# EAGLE board reg-board (EAGLE 8.7.0)
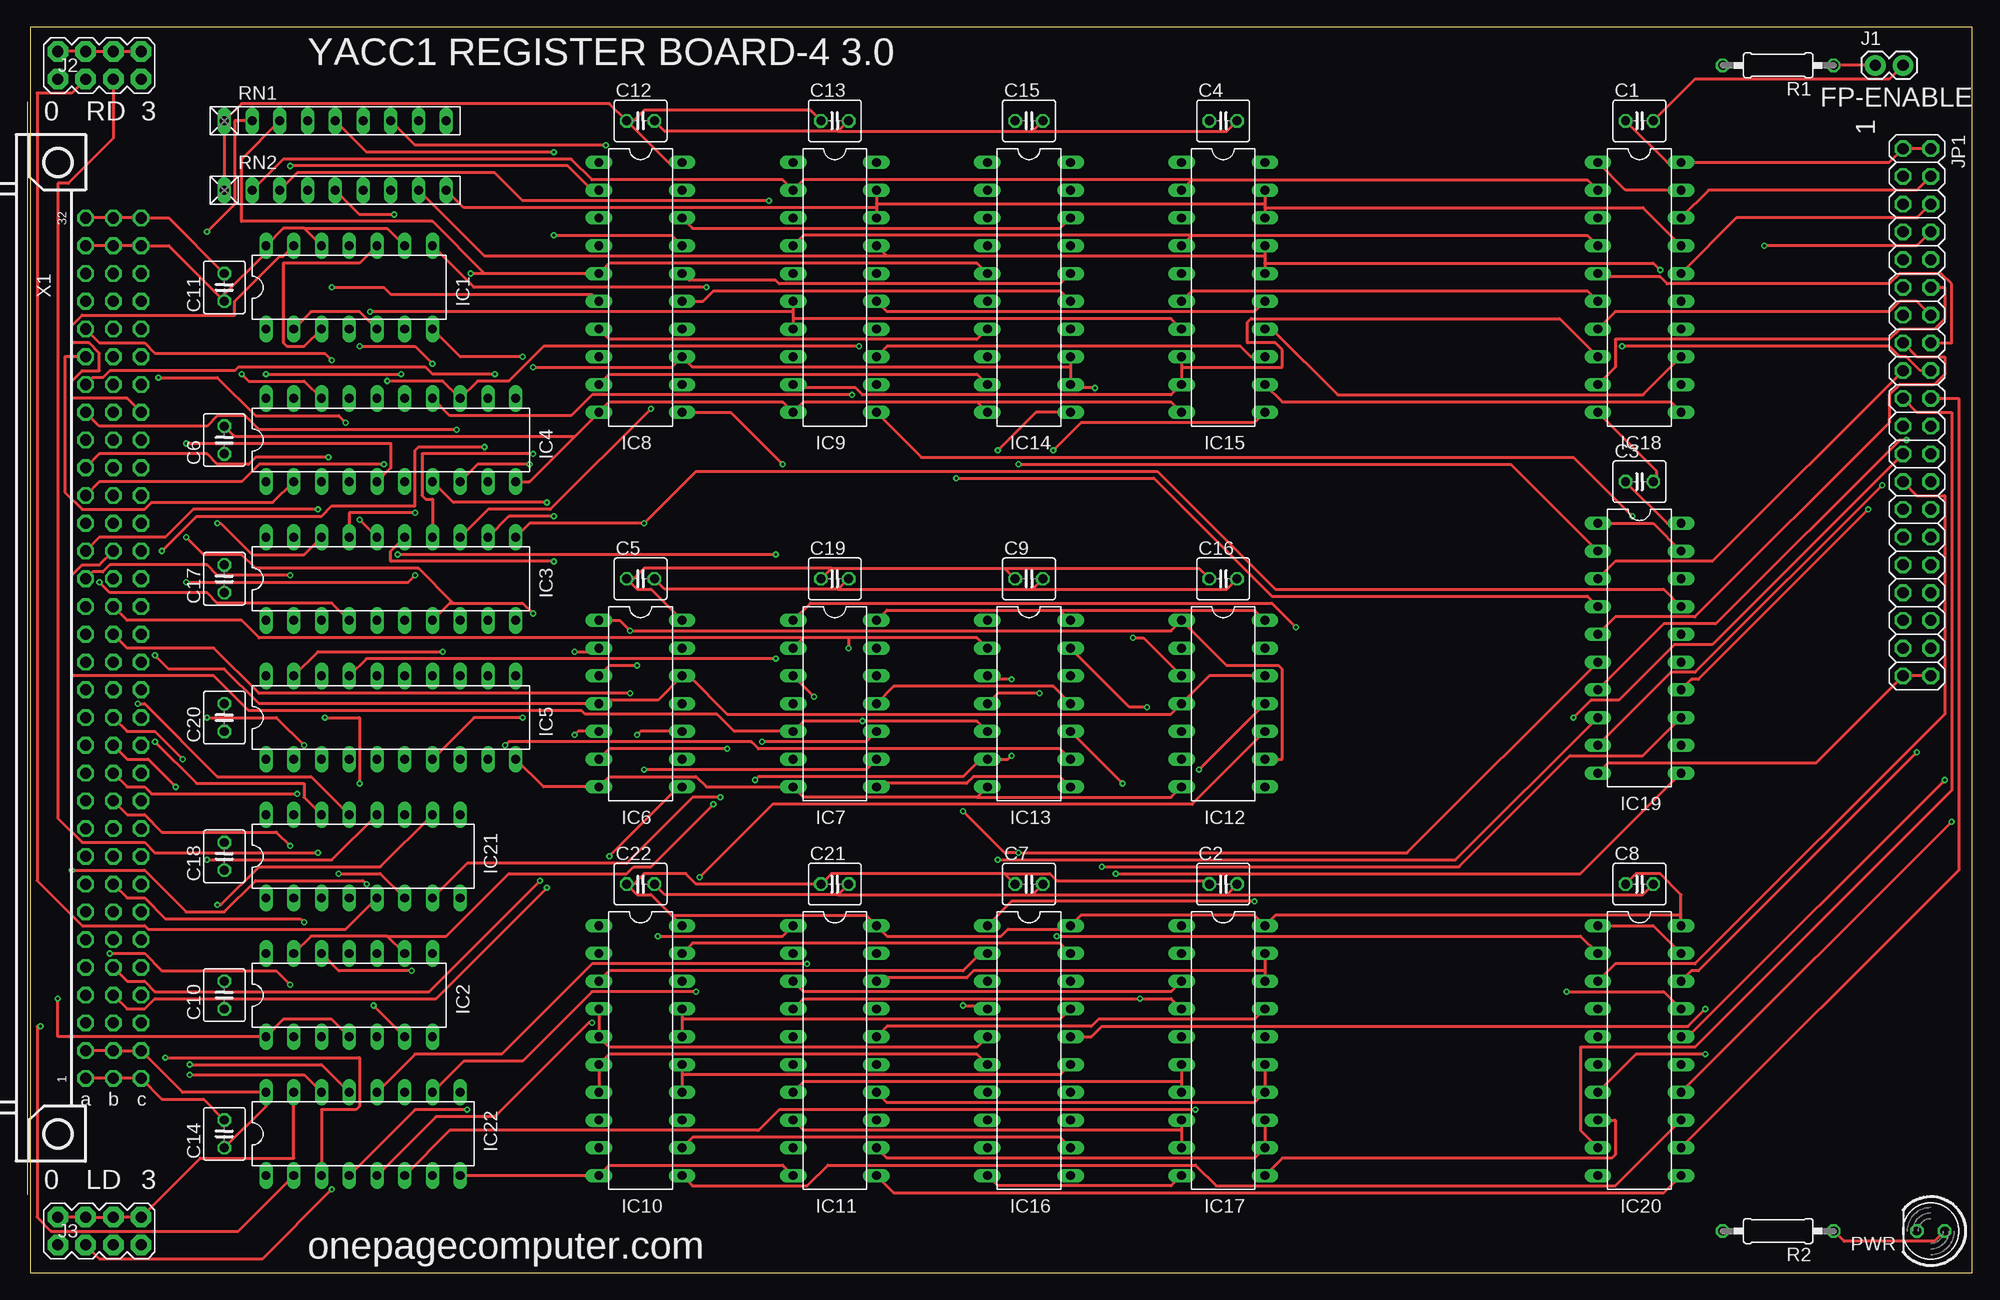
[diagram p5: board, top side]
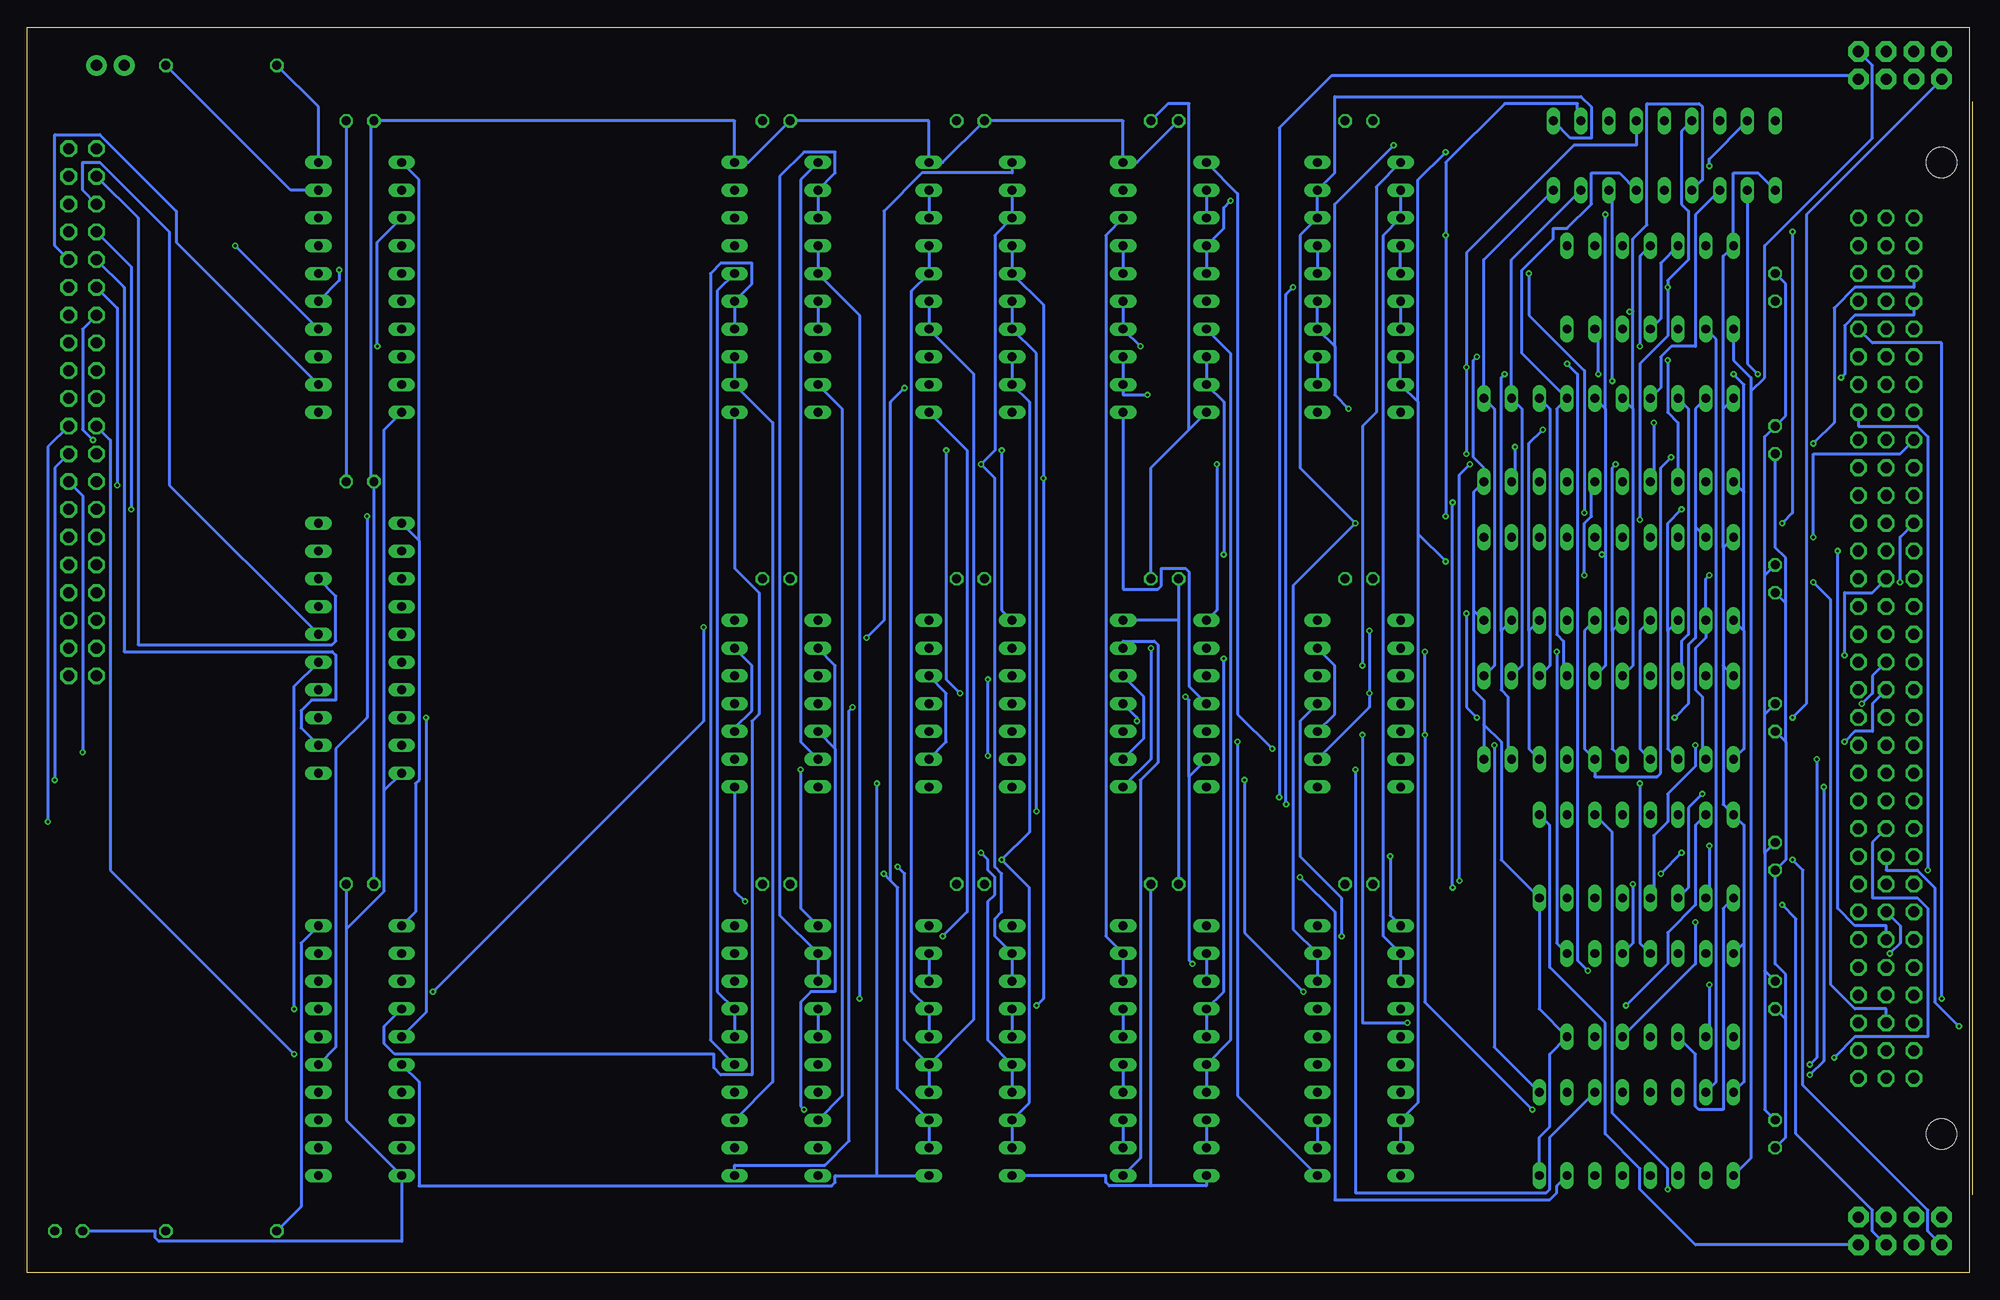
[diagram p6: board, bottom side, seen from below]

Size 177.78 x 113.97 mm. Coordinates in mm from the lower left corner, seen from the top.
Outline: 0,0 177.78,0 177.78,113.97 0,113.97 0,0
Copper layers (1*16): Top 0.035559375mm / dielectric 1.6mm / Bottom 0.035559375mm
Design rules "oshpark-2layer-auto-routing": minimum track width 10mil, minimum drill 10mil, track to track 10mil, track to pad 8mil, pad to pad 8mil, via to via 8mil, smd to smd 6mil, copper to edge 15mil, drill to drill 6mil, minimum pad ring 6mil, minimum via ring 6mil, stop-mask expansion 2.5mil, vias tented up to drill 0mil, thermal gap 10mil
Net classes: 1 GND: width 1 mm; 2 5V: width 1 mm

## Footprints (pad centres in the part's own frame; a part is rotated, then mirrored left to right if it is on the bottom)
C025-040X050 = drill 0.813 octagon: 1 -1.27,0; 2 1.27,0
DIL14 = drill 0.813 long: 1 -7.62,-3.81; 2 -5.08,-3.81; 3 -2.54,-3.81; 4 0,-3.81; 5 2.54,-3.81; 6 5.08,-3.81; 7 7.62,-3.81; 8 7.62,3.81; 9 5.08,3.81; 10 2.54,3.81; 11 0,3.81; 12 -2.54,3.81; 13 -5.08,3.81; 14 -7.62,3.81
DIL20 = drill 0.813 long: 1 -11.43,-3.81; 2 -8.89,-3.81; 3 -6.35,-3.81; 4 -3.81,-3.81; 5 -1.27,-3.81; 6 1.27,-3.81; 7 3.81,-3.81; 8 6.35,-3.81; 9 8.89,-3.81; 10 11.43,-3.81; 11 11.43,3.81; 12 8.89,3.81; 13 6.35,3.81; 14 3.81,3.81; 15 1.27,3.81; 16 -1.27,3.81; 17 -3.81,3.81; 18 -6.35,3.81; 19 -8.89,3.81; 20 -11.43,3.81
DIL16 = drill 0.813 long: 1 -8.89,-3.81; 2 -6.35,-3.81; 3 -3.81,-3.81; 4 -1.27,-3.81; 5 1.27,-3.81; 6 3.81,-3.81; 7 6.35,-3.81; 8 8.89,-3.81; 9 8.89,3.81; 10 6.35,3.81; 11 3.81,3.81; 12 1.27,3.81; 13 -1.27,3.81; 14 -3.81,3.81; 15 -6.35,3.81; 16 -8.89,3.81
1X02 = drill 1.016 pad 1.88: 1 0,0; 2 2.54,0
2X4 = drill 1.016 pad 1.88 octagon: 1 -3.81,-1.27; 2 -3.81,1.27; 3 -1.27,-1.27; 4 -1.27,1.27; 5 1.27,-1.27; 6 1.27,1.27; 7 3.81,-1.27; 8 3.81,1.27
2X20 = drill 1.016 octagon: 1 -24.13,-1.27; 2 -24.13,1.27; 3 -21.59,-1.27; 4 -21.59,1.27; 5 -19.05,-1.27; 6 -19.05,1.27; 7 -16.51,-1.27; 8 -16.51,1.27; 9 -13.97,-1.27; 10 -13.97,1.27; 11 -11.43,-1.27; 12 -11.43,1.27; 13 -8.89,-1.27; 14 -8.89,1.27; 15 -6.35,-1.27; 16 -6.35,1.27; 17 -3.81,-1.27; 18 -3.81,1.27; 19 -1.27,-1.27; 20 -1.27,1.27; 21 1.27,-1.27; 22 1.27,1.27; 23 3.81,-1.27; 24 3.81,1.27; 25 6.35,-1.27; 26 6.35,1.27; 27 8.89,-1.27; 28 8.89,1.27; 29 11.43,-1.27; 30 11.43,1.27; 31 13.97,-1.27; 32 13.97,1.27; 33 16.51,-1.27; 34 16.51,1.27; 35 19.05,-1.27; 36 19.05,1.27; 37 21.59,-1.27; 38 21.59,1.27; 39 24.13,-1.27; 40 24.13,1.27
LED5MM = drill 0.813 octagon: A -1.27,0; K 1.27,0
0207/10 = drill 0.813 octagon: 1 -5.08,0; 2 5.08,0
RN-9 = drill 0.813 long: 1 -10.16,0; 2 -7.62,0; 3 -5.08,0; 4 -2.54,0; 5 0,0; 6 2.54,0; 7 5.08,0; 8 7.62,0; 9 10.16,0
FABC96R = drill 1.016 octagon: A1 -2.54,39.37; A2 -2.54,36.83; A3 -2.54,34.29; A4 -2.54,31.75; A5 -2.54,29.21; A6 -2.54,26.67; A7 -2.54,24.13; A8 -2.54,21.59; A9 -2.54,19.05; A10 -2.54,16.51; A11 -2.54,13.97; A12 -2.54,11.43; A13 -2.54,8.89; A14 -2.54,6.35; A15 -2.54,3.81; A16 -2.54,1.27; A17 -2.54,-1.27; A18 -2.54,-3.81; A19 -2.54,-6.35; A20 -2.54,-8.89; A21 -2.54,-11.43; A22 -2.54,-13.97; A23 -2.54,-16.51; A24 -2.54,-19.05; A25 -2.54,-21.59; A26 -2.54,-24.13; A27 -2.54,-26.67; A28 -2.54,-29.21; A29 -2.54,-31.75; A30 -2.54,-34.29; A31 -2.54,-36.83; A32 -2.54,-39.37; B1 -5.08,39.37; B2 -5.08,36.83; B3 -5.08,34.29; B4 -5.08,31.75; B5 -5.08,29.21; B6 -5.08,26.67; B7 -5.08,24.13; B8 -5.08,21.59; B9 -5.08,19.05; B10 -5.08,16.51; B11 -5.08,13.97; B12 -5.08,11.43; B13 -5.08,8.89; B14 -5.08,6.35; B15 -5.08,3.81; B16 -5.08,1.27; B17 -5.08,-1.27; B18 -5.08,-3.81; B19 -5.08,-6.35; B20 -5.08,-8.89; B21 -5.08,-11.43; B22 -5.08,-13.97; B23 -5.08,-16.51; B24 -5.08,-19.05; B25 -5.08,-21.59; B26 -5.08,-24.13; B27 -5.08,-26.67; B28 -5.08,-29.21; B29 -5.08,-31.75; B30 -5.08,-34.29; B31 -5.08,-36.83; B32 -5.08,-39.37; C1 -7.62,39.37; C2 -7.62,36.83; C3 -7.62,34.29; C4 -7.62,31.75; C5 -7.62,29.21; C6 -7.62,26.67; C7 -7.62,24.13; C8 -7.62,21.59; C9 -7.62,19.05; C10 -7.62,16.51; C11 -7.62,13.97; C12 -7.62,11.43; C13 -7.62,8.89; C14 -7.62,6.35; C15 -7.62,3.81; C16 -7.62,1.27; C17 -7.62,-1.27; C18 -7.62,-3.81; C19 -7.62,-6.35; C20 -7.62,-8.89; C21 -7.62,-11.43; C22 -7.62,-13.97; C23 -7.62,-16.51; C24 -7.62,-19.05; C25 -7.62,-21.59; C26 -7.62,-24.13; C27 -7.62,-26.67; C28 -7.62,-29.21; C29 -7.62,-31.75; C30 -7.62,-34.29; C31 -7.62,-36.83; C32 -7.62,-39.37 | hole 2.794: 0,-44.456; 0,44.456

## Placement (x,y rotation side)
C1  .1uf  [C025-040X050]  147.32,105.41 0 top
C2  .1uf  [C025-040X050]  109.22,35.56 0 top
C3  .1uf  [C025-040X050]  147.32,72.39 0 top
C4  .1uf  [C025-040X050]  109.22,105.41 0 top
C5  .1uf  [C025-040X050]  55.88,63.5 0 top
C6  .1uf  [C025-040X050]  17.78,76.2 90 top
C7  .1uf  [C025-040X050]  91.44,35.56 0 top
C8  .1uf  [C025-040X050]  147.32,35.56 0 top
C9  .1uf  [C025-040X050]  91.44,63.5 0 top
C10  .1uf  [C025-040X050]  17.78,25.4 90 top
C11  .1uf  [C025-040X050]  17.78,90.17 90 top
C12  .1uf  [C025-040X050]  55.88,105.41 0 top
C13  .1uf  [C025-040X050]  73.66,105.41 0 top
C14  .1uf  [C025-040X050]  17.78,12.7 90 top
C15  .1uf  [C025-040X050]  91.44,105.41 0 top
C16  .1uf  [C025-040X050]  109.22,63.5 0 top
C17  .1uf  [C025-040X050]  17.78,63.5 90 top
C18  .1uf  [C025-040X050]  17.78,38.1 90 top
C19  .1uf  [C025-040X050]  73.66,63.5 0 top
C20  .1uf  [C025-040X050]  17.78,50.8 90 top
C21  .1uf  [C025-040X050]  73.66,35.56 0 top
C22  .1uf  [C025-040X050]  55.88,35.56 0 top
IC1  74LS86N  [DIL14]  29.21,90.17 0 top
IC2  74LS32N  [DIL14]  29.21,25.4 0 top
IC3  74LS245N  [DIL20]  33.02,63.5 0 top
IC4  74LS245N  [DIL20]  33.02,76.2 0 top
IC5  74LS245N  [DIL20]  33.02,50.8 0 top
IC6  7432N  [DIL14]  55.88,52.07 270 top
IC7  74LS02N  [DIL14]  73.66,52.07 270 top
IC8  74S374N  [DIL20]  55.88,90.17 270 top
IC9  74S374N  [DIL20]  73.66,90.17 270 top
IC10  74S374N  [DIL20]  55.88,20.32 270 top
IC11  74S374N  [DIL20]  73.66,20.32 270 top
IC12  7432N  [DIL14]  109.22,52.07 270 top
IC13  74LS02N  [DIL14]  91.44,52.07 270 top
IC14  74S374N  [DIL20]  91.44,90.17 270 top
IC15  74S374N  [DIL20]  109.22,90.17 270 top
IC16  74S374N  [DIL20]  91.44,20.32 270 top
IC17  74S374N  [DIL20]  109.22,20.32 270 top
IC18  74LS244N  [DIL20]  147.32,90.17 270 top
IC19  74LS244N  [DIL20]  147.32,57.15 270 top
IC20  74LS244N  [DIL20]  147.32,20.32 270 top
IC21  74LS139N  [DIL16]  30.48,38.1 0 top
IC22  74LS139N  [DIL16]  30.48,12.7 0 top
J1  [1X02]  168.91,110.49 0 top
J2  [2X4]  6.35,110.49 0 top
J3  [2X4]  6.35,3.81 0 top
JP1  [2X20]  172.72,78.74 270 top
PWR  [LED5MM]  173.99,3.81 180 top
R1  10k  [0207/10]  160.02,110.49 180 top
R2  330  [0207/10]  160.02,3.81 180 top
RN1  10k  [RN-9]  27.94,105.41 0 top
RN2  10k  [RN-9]  27.94,99.06 0 top
X1  FABC96R  [FABC96R]  2.54,57.15 180 top

## Tracks (layer width: path | path; a pad name or v marks a point on that pad's centre or on a via)
-BUS-EN  (via drill 0.25)
  Top 0.254: IC2.4 27.62,23.18 23.18,23.18 IC2.1 2.54,21.59 v2.54,25.08
  Bottom 0.254: X1.C28 8.89,85.09 2.54,85.09 v2.54,25.08
-HL-SWAP  (via drill 0.25)
  Top 0.254: v30.8,35.56 30.48,35.88 20.64,35.88 17.78,33.02 14.29,33.02 10.48,36.83 v3.81,36.83 | IC1.13 23.18,93.03 22.86,93.03 18.73,88.9 18.73,87.63 4.76,87.63 3.81,86.68 3.81,85.09 5.4,85.09 6.35,84.14 6.35,82.55 4.76,82.55 3.81,81.6 3.81,80.01 8.89,80.01 X1.C25
  Bottom 0.254: IC2.10 30.8,30.16 v30.8,35.56 | v3.81,36.83 3.81,76.52 4.76,77.47 10.16,77.47 X1.C25
-LDSEL
  Top 0.254: J3.2 J3.4 J3.6 J3.8 15.56,10.48 24.13,10.48 IC22.15 | IC1.2 25.72,87.95 30.16,87.95 IC1.5
  Bottom 0.254: IC1.2 23.18,85.41 23.18,17.46 IC22.15
-R0-LDSEL  (via drill 0.25)
  Top 0.254: IC22.12 35.24,20 43.18,20 51.44,28.26 v71.12,28.26 | v71.75,52.7 IC7.3
  Bottom 0.254: v71.12,28.26 71.44,28.57 71.44,45.4 | IC7.6 71.44,45.4 | v71.75,52.7 71.44,52.39 71.44,45.4
-R0-RDSEL  (via drill 0.25)
  Top 0.254: IC22.4 35.24,14.92 v40.01,14.92 | v49.85,49.21 50.16,49.53 IC6.5 | IC6.2 51.75,56.83 v49.85,56.83
  Bottom 0.254: v40.01,14.92 49.85,24.77 v49.85,49.21 v49.85,56.83
-R1-LDSEL  (via drill 0.25)
  Top 0.254: v56.2,46.04 76.52,46.04 IC7.9
  Bottom 0.254: IC22.11 38.42,12.38 38.42,7.62 38.73,7.3 56.2,7.3 v56.2,46.04 | IC7.12 75.56,52.7 75.56,48.9 IC7.9
-R1-RDSEL  (via drill 0.25)
  Top 0.254: IC22.5 37.15,14.29 42.55,14.29 51.12,22.86 v51.44,22.86 | v55.56,49.21 55.88,49.53 IC6.10
  Bottom 0.254: v51.44,22.86 55.56,22.86 v55.56,49.21 | IC6.13 58.1,55.56 58.1,51.12 IC6.10
-R2-LDSEL  (via drill 0.25)
  Top 0.254: IC22.10 39.69,19.37 45.09,19.37 51.44,25.72 v60.96,25.72 | v66.36,45.09 66.67,45.4 85.41,45.4 87,46.99 IC13.6 89.53,46.99 v89.85,47.31 | IC13.3 87.95,54.29 v89.85,54.29
  Bottom 0.254: v60.96,25.72 66.36,31.11 v66.36,45.09 | v89.85,47.31 v89.85,54.29
-R2-RDSEL  (via drill 0.25)
  Top 0.254: IC22.6 38.42,13.02 66.67,13.02 68.58,14.92 v106.68,14.92
  Bottom 0.254: v106.68,14.92 107,15.24 107,24.77 106.05,25.72 103.82,25.72 103.82,47.94 | IC12.5 103.82,47.94 | IC12.2 103.82,55.56 103.82,47.94
-R3-LDSEL  (via drill 0.25)
  Top 0.254: v43.5,48.26 43.81,48.58 66.04,48.58 66.67,47.94 94.3,47.94 IC13.9
  Bottom 0.254: IC22.9 43.5,20.64 v43.5,48.26 | IC13.12 93.66,53.02 93.66,48.58 IC13.9
-R3-RDSEL  (via drill 0.25)
  Top 0.254: v61.28,36.2 67.94,42.86 106.36,42.86 IC12.10
  Bottom 0.254: IC22.7 37.78,7.94 37.78,7.3 38.42,6.67 58.1,6.67 58.1,33.02 v61.28,36.2 | IC12.13 111.44,55.56 111.44,51.44 113.03,49.85 IC12.10
-RDSEL
  Top 0.254: J2.2 J2.4 J2.6 J2.8
  Bottom 0.254: IC22.1 20,10.48 20,80.64 | 20,80.64 20,81.92 21.59,83.5 IC1.1 | J2.8 8.89,110.49 8.89,103.82 18.73,93.98 18.73,81.92 20,80.64
-REG-FUNC-LD  (via drill 0.25)
  Top 0.254: v25.08,32.07 24.77,32.38 12.38,32.38 10.48,34.29 8.89,34.29 X1.B8
  Bottom 0.254: IC2.5 25.08,28.26 v25.08,32.07
-REG-FUNC-RD  (via drill 0.25)
  Top 0.254: v23.81,26.35 22.54,27.62 12.06,27.62 10.48,29.21 v7.3,29.21
  Bottom 0.254: IC2.2 23.81,21.91 v23.81,26.35 | v7.3,29.21 6.35,30.16 6.35,31.75 X1.B7
-REG-LD-HI  (via drill 0.25)
  Top 0.254: IC7.11 79.06,53.66 93.66,53.66 IC13.11 | IC13.5 86.68,50.48 v76.2,50.48 70.8,50.48 IC7.5 64.45,49.53 62.87,51.12 50.8,51.12 50.48,51.44 20,51.44 16.83,54.61 3.81,54.61 3.81,63.82 4.76,64.77 6.35,64.77 X1.B20
  Bottom 0.254: IC7.11 76.2,50.8 v76.2,50.48
-REG-LD-LO  (via drill 0.25)
  Top 0.254: IC7.8 77.79,44.77 85.72,44.77 86.36,45.4 94.3,45.4 IC13.8 | 70.8,58.1 IC7.2 | 74.93,58.1 86.68,58.1 IC13.2 | 74.93,58.1 70.8,58.1 | X1.B18 8.89,59.69 19.37,59.69 20.95,58.1 70.8,58.1 | 74.93,58.1 v74.93,57.15
  Bottom 0.254: IC7.8 74.93,46.99 v74.93,57.15
-REG-RD-HI  (via drill 0.25)
  Top 0.254: IC12.12 107.95,54.61 IC12.4 104.46,51.12 63.82,51.12 60.33,54.61 IC6.12 57.47,52.39 52.39,52.39 IC6.4 20.95,52.07 17.78,55.24 12.7,55.24 v11.43,56.52
  Bottom 0.254: X1.B19 8.89,62.23 11.43,62.23 v11.43,56.52
-REG-RD-LO  (via drill 0.25)
  Top 0.254: IC12.9 114.62,46.99 114.62,55.24 114.3,55.56 109.54,55.56 IC12.1 104.46,58.74 v54.93,58.74 53.98,59.69 IC6.1 | X1.B17 8.89,57.15 16.83,57.15 20.95,53.02 v54.93,53.02
  Bottom 0.254: IC6.9 54.93,51.75 v54.93,53.02 v54.93,58.74
-RLD0  (via drill 0.25)
  Top 0.254: IC21.12 27.62,37.78 v16.19,37.78
  Bottom 0.254: v16.19,37.78 15.24,36.83 15.24,17.14 3.81,5.71 3.81,3.81 J3.1
-RRD0  (via drill 0.25)
  Top 0.254: v25.08,48.26 22.54,50.8 v16.19,50.8
  Bottom 0.254: IC21.4 28.89,34.61 28.89,40.01 27.62,41.27 27.62,43.81 25.08,46.35 v25.08,48.26 | v16.19,50.8 14.92,52.07 14.92,96.84 J2.1
ADATA0  (via drill 0.25)
  Top 0.254: IC19.2 135.57,73.98 v90.49,73.98 | IC3.18 25.08,65.72 20.32,65.72 17.46,68.58 v17.14,68.58 | v16.19,95.25 18.73,97.79 18.73,105.41 RN1.2 | IC10.3 53.02,27.62 85.41,27.62 87,29.21 IC16.2 | v23.81,101.28 49.21,101.28 51.44,99.06 IC8.2
  Bottom 0.254: IC14.2 IC14.3 89.22,94.93 89.22,75.25 v90.49,73.98 89.22,72.71 89.22,37.15 88.58,36.51 88.58,33.02 89.22,32.38 89.22,30.8 IC16.2 IC16.3 | v17.14,68.58 16.19,69.53 v16.19,95.25 | IC8.2 IC8.3 53.66,94.93 53.66,30.8 IC10.2 IC10.3 | RN1.2 23.81,101.92 v23.81,101.28
ADATA1  (via drill 0.25)
  Top 0.254: IC3.17 29.21,69.53 v35.24,69.53 | 41.59,91.44 IC8.5 53.02,92.39 86.68,92.39 IC14.5 | 41.59,91.44 v40.32,91.44 | RN1.3 19.37,101.92 19.37,96.2 36.83,96.2 41.59,91.44 | IC10.4 IC10.5 53.02,20.64 86.68,20.64 IC16.5 | IC19.4 142.56,61.91 113.67,61.91 102.87,72.71 v84.77,72.71 | IC16.4 87.31,24.45 v85.41,24.45
  Bottom 0.254: v35.24,69.53 35.24,82.55 40.32,87.63 v40.32,91.44 | IC8.5 IC8.4 | IC16.4 IC16.5 | IC14.4 IC14.5 84.77,88.58 v84.77,72.71 84.77,25.08 v85.41,24.45
ADATA2  (via drill 0.25)
  Top 0.254: IC8.7 53.02,85.41 86.68,85.41 IC14.7 | v30.16,68.9 IC3.16 | IC8.6 51.44,89.53 33.02,89.53 32.38,90.17 v27.62,90.17 | IC10.7 IC10.6 53.02,20 86.68,20 IC16.6 | IC19.6 126.05,38.42 v90.49,38.42 89.22,38.42 v85.41,42.23
  Bottom 0.254: IC8.6 IC8.7 | IC14.6 IC14.7 85.41,84.14 v85.41,42.23 | v30.16,68.9 30.16,83.19 27.62,85.72 v27.62,90.17 27.62,90.81 25.72,92.71 25.72,97.16 26.35,97.79 26.35,104.46 RN1.4 | IC16.7 IC16.6 89.85,21.27 89.85,33.97 89.22,34.61 89.22,36.2 89.85,36.83 89.85,37.78 v90.49,38.42
ADATA3  (via drill 0.25)
  Top 0.254: IC19.8 130.49,37.78 v88.58,37.78 | IC3.15 33.02,66.04 33.02,65.09 v47.94,65.09 | RN1.5 30.8,102.55 v47.94,102.55 | IC14.9 86.68,82.23 53.02,82.23 IC8.9
  Bottom 0.254: IC16.9 IC16.8 86.04,15.56 86.04,35.24 v88.58,37.78 86.04,40.32 86.04,79.69 IC14.9 IC14.8 | IC10.9 IC10.8 50.48,15.56 50.48,67.63 | 50.48,67.63 v47.94,65.09 | 50.48,79.69 50.48,67.63 | 50.48,79.69 IC8.9 IC8.8 | v47.94,102.55 50.48,100.01 50.48,79.69
ADATA4  (via drill 0.25)
  Top 0.254: IC14.13 95.25,82.87 | 95.25,82.87 IC14.12 95.57,80.96 v97.47,80.96 | 95.25,82.87 60.64,82.87 IC8.13 58.74,82.87 v46.04,82.87 | IC3.14 36.83,70.8 36.2,70.8 35.88,71.12 35.88,74.93 v46.04,74.93 | IC19.11 141.92,36.51 v99.38,36.51 | IC10.12 60.64,12.38 94.3,12.38 IC16.12
  Bottom 0.254: IC8.13 IC8.12 | v46.04,74.93 v46.04,82.87 46.04,93.34 36.2,103.19 30.48,103.19 RN1.6 | IC10.13 IC10.12 | IC16.12 IC16.13 98.11,16.83 98.11,35.24 98.74,35.88 | 98.74,35.88 v99.38,36.51 | v97.47,80.96 98.74,79.69 98.74,35.88
ADATA5  (via drill 0.25)
  Top 0.254: IC3.13 41.91,69.85 47.62,69.85 v56.83,79.06 | RN1.7 35.24,103.19 v52.7,103.19 | IC14.15 94.3,89.85 62.55,89.85 61.59,88.9 IC8.15 | IC10.15 59.69,18.1 | 59.69,18.1 IC10.14 | IC19.13 147.64,47.31 140.97,47.31 130.81,37.15 v98.11,37.15 | 59.69,18.1 94.3,18.1 IC16.15
  Bottom 0.254: IC14.15 IC14.14 91.12,82.23 91.12,23.18 IC16.15 | v56.83,79.06 58.1,80.33 58.1,84.77 | 58.1,84.77 IC8.14 IC8.15 | v52.7,103.19 58.1,97.79 58.1,84.77 | IC16.15 IC16.14 | v98.11,37.15 97.47,36.51 97.47,21.27 IC16.15
ADATA6  (via drill 0.25)
  Top 0.254: IC8.16 60.33,90.81 68.26,90.81 68.58,90.49 94.3,90.49 IC14.16 | IC3.12 43.81,69.22 v47.94,69.22 | IC8.17 58.74,94.93 v47.94,94.93 | IC10.17 59.69,23.18 | 59.69,23.18 IC10.16 | v153.35,24.13 151.76,22.54 98.11,22.54 97.16,21.59 IC16.16 | 59.69,23.18 94.3,23.18 IC16.17
  Bottom 0.254: IC8.17 IC8.16 | IC14.17 IC14.16 96.84,89.85 96.84,25.72 IC16.17 IC16.16 | v47.94,69.22 v47.94,94.93 47.94,101.6 42.55,107 35.88,107 35.88,105.73 RN1.8 | IC19.15 153.35,53.66 v153.35,24.13
ADATA7  (via drill 0.25)
  Top 0.254: IC10.19 60.64,30.16 94.3,30.16 IC16.19 | IC3.11 45.72,68.58 v56.2,68.58 60.96,73.34 103.19,73.34 113.98,62.55 149.54,62.55 IC19.17 | IC14.18 94.3,95.57 60.64,95.57 IC8.18
  Bottom 0.254: IC10.18 IC10.19 61.91,31.43 61.91,62.87 v56.2,68.58 61.28,73.66 61.28,94.93 IC8.18 IC8.19 58.1,100.65 58.1,107.63 35.56,107.63 34.61,106.68 34.61,103.82 36.51,103.82 RN1.9 | IC16.19 IC16.18 | IC14.19 IC14.18
ADATA8  (via drill 0.25)
  Top 0.254: RN2.2 23.18,101.92 49.53,101.92 51.44,100.01 68.9,100.01 IC9.2 70.8,100.01 106.36,100.01 | IC4.18 25.08,81.6 20,81.6 v19.37,82.23 | IC11.3 70.8,25.72 104.46,25.72 IC17.3 | IC18.2 142.56,100.01 106.36,100.01 | IC15.2 106.36,100.01
  Bottom 0.254: IC5.18 26.35,54.93 26.35,57.78 25.72,58.42 25.72,79.06 IC4.18 | IC9.2 IC9.3 | v19.37,82.23 20.32,83.19 RN2.2 | IC11.2 IC11.3 | IC17.3 IC17.2 108.9,32.7 108.9,100.33 106.68,102.55 103.82,102.55 103.82,100.65 IC15.2 IC15.3
ADATA9  (via drill 0.25)
  Top 0.254: IC5.17 30.8,56.2 v68.26,56.2 | IC17.4 104.46,25.08 v101.6,25.08 70.8,25.08 IC11.4 | IC18.4 142.56,94.93 106.36,94.93 | IC15.4 106.36,94.93 | IC9.4 70.8,94.93 106.36,94.93 | RN2.3 24.45,100.65 42.55,100.65 45.09,98.11 v67.63,98.11
  Bottom 0.254: IC17.4 IC17.5 | v68.26,56.2 68.26,25.72 IC11.4 IC11.5 | IC4.17 28.26,80.96 28.26,83.82 27.3,84.77 25.08,84.77 25.08,96.84 RN2.3 | IC9.5 IC9.4 68.26,95.57 68.26,97.47 v67.63,98.11 | IC15.4 IC15.5 101.6,87.63 v101.6,25.08
ADATA10  (via drill 0.25)
  Top 0.254: IC17.6 105.41,17.46 | 105.41,17.46 IC17.7 | IC11.7 70.8,17.46 105.41,17.46 | IC9.6 69.85,87.95 | 69.85,87.95 69.85,87.31 | 69.85,87.31 IC9.7 | IC18.6 142.56,89.85 106.36,89.85 IC15.6 | 69.85,87.31 104.46,87.31 IC15.7 | 69.85,87.95 v31.11,87.95
  Bottom 0.254: IC5.16 30.8,55.56 30.8,79.06 | IC4.16 30.8,79.06 | RN2.4 24.45,100.01 24.45,106.68 24.77,107 29.53,107 29.53,95.89 30.8,94.61 30.8,87.95 | 30.8,79.06 30.8,87.95 | IC11.7 IC11.6 67.63,21.27 67.63,84.14 IC9.7 | IC15.6 IC15.7 | v31.11,87.95 30.8,87.95
ADATA11  (via drill 0.25)
  Top 0.254: RN2.5 30.16,96.84 v33.34,96.84 | IC17.8 105.41,13.02 | 105.41,13.02 IC17.9 | IC11.8 70.8,13.02 105.41,13.02 | IC15.8 105.41,82.87 | 105.41,82.87 IC15.9 104.46,80.33 76.2,80.33 75.56,80.96 70.17,80.96 IC9.9 | IC18.8 140.02,87.31 111.76,87.31 111.44,87 111.44,85.09 113.98,85.09 114.62,84.45 114.62,82.87 105.41,82.87 | v68.26,65.72 v33.66,65.72
  Bottom 0.254: IC5.15 33.34,55.56 33.34,65.72 | 33.34,79.06 33.34,65.72 | IC4.15 33.34,79.06 | 33.34,79.06 v33.34,96.84 | IC11.8 IC11.9 | IC9.8 IC9.9 68.26,79.69 v68.26,65.72 | IC17.8 103.19,16.19 103.19,79.06 IC15.9 | v33.66,65.72 33.34,65.72
ADATA12  (via drill 0.25)
  Top 0.254: IC17.13 IC17.12 112.08,10.48 78.42,10.48 IC11.12 | IC18.11 150.18,79.69 114.62,79.69 IC15.12 | IC9.13 78.42,84.77 110.81,84.77 111.76,83.82 IC15.13 | IC4.14 38.42,78.42 49.53,78.42 51.44,80.33 v75.25,80.33
  Bottom 0.254: IC5.14 37.15,54.93 37.15,57.78 37.78,58.42 37.78,79.06 IC4.14 40.96,84.14 40.96,91.76 38.1,94.61 38.1,95.57 36.83,95.57 34.61,97.79 34.61,100.65 32.07,100.65 RN2.6 | IC11.13 IC11.12 | IC9.13 IC9.12 77.47,80.33 v75.25,80.33 | IC15.13 IC15.12 109.54,77.79 109.54,17.46 IC17.13
ADATA13  (via drill 0.25)
  Top 0.254: v32.7,81.6 37.78,81.6 IC4.13 40.96,81.6 43.81,81.6 46.99,84.77 v75.88,84.77 | IC17.15 IC17.14 112.08,15.56 78.42,15.56 IC11.14 | IC18.13 147.64,80.33 119.7,80.33 113.67,86.36 IC15.14 | IC9.15 78.42,87.95 112.08,87.95 IC15.15
  Bottom 0.254: IC5.13 38.42,55.56 38.42,79.06 IC4.13 | RN2.7 32.7,98.74 v32.7,81.6 | IC11.15 IC11.14 | IC9.15 IC9.14 v75.88,84.77 | IC15.14 IC15.15 111.44,90.49 111.44,92.39 114.3,92.39 115.25,91.44 115.25,21.27 IC17.15
ADATA14  (via drill 0.25)
  Top 0.254: IC11.16 78.42,22.54 97.16,22.54 97.79,23.18 112.08,23.18 IC17.17 | IC15.17 113.03,93.03 | 113.03,93.03 113.03,92.39 | 113.03,92.39 IC15.16 | v149.22,91.76 148.59,92.39 113.03,92.39 | 78.42,93.03 IC9.17 | 113.03,93.03 78.42,93.03 | RN2.8 41.59,93.03 78.42,93.03
  Bottom 0.254: IC5.12 40.96,55.56 40.96,79.06 IC4.12 41.91,92.71 RN2.8 | IC11.17 IC11.16 | IC17.16 IC17.17 114.62,25.72 114.62,89.85 IC15.16 | IC9.17 IC9.16 | IC18.15 149.22,90.81 v149.22,91.76
ADATA15
  Top 0.254: IC17.19 113.03,27.62 | 113.03,27.62 IC17.18 | IC11.18 77.79,26.99 85.72,26.99 86.36,27.62 113.03,27.62 | IC9.19 77.47,97.79 | 77.47,97.79 77.47,97.47 | 77.47,97.47 IC9.18 | IC15.19 113.03,97.79 | 113.03,97.79 113.03,97.47 | 113.03,97.47 IC15.18 | IC18.17 147.64,97.47 113.03,97.47 | 113.03,97.79 77.47,97.79 | RN2.9 39.69,97.47 77.47,97.47
  Bottom 0.254: IC5.11 43.5,55.56 43.5,79.06 IC4.11 44.45,92.71 RN2.9 | IC11.18 IC11.19 79.06,30.8 79.06,94.93 IC9.18
BUS-DIR  (via drill 0.25)
  Top 0.254: v21.59,82.23 v33.97,82.23
  Bottom 0.254: IC5.1 20.64,47.94 20.64,58.74 | IC3.1 20.64,58.74 | 20.64,71.44 IC4.1 | 20.64,58.74 20.64,71.44 | IC1.6 33.97,86.04 v33.97,82.23 | v21.59,82.23 20.64,81.28 20.64,71.44
CLK0H  (via drill 0.25)
  Top 0.254: v146.69,69.22 141.29,74.61 81.6,74.61 IC9.11
  Bottom 0.254: IC7.4 71.44,53.66 71.44,64.14 71.75,64.45 73.98,64.45 73.98,62.87 74.3,62.55 77.47,62.55 IC9.11 | IC20.15 149.54,20.64 149.54,47.94 146.69,50.8 v146.69,69.22
CLK0L  (via drill 0.25)
  Top 0.254: v68.9,73.98 64.14,78.74 IC8.11 | IC20.17 149.54,25.72 v140.65,25.72 | v115.89,59.05 113.67,61.28 71.44,61.28 IC7.1
  Bottom 0.254: IC7.1 68.9,60.64 v68.9,73.98 | v140.65,25.72 115.89,50.48 v115.89,59.05
CLK1H
  Top 0.254: IC20.11 149.54,7.3 79.06,7.3 IC11.11
  Bottom 0.254: IC11.11 75.88,10.48 75.88,45.09 74.3,46.67 74.3,57.47 74.61,57.78 77.47,57.78 IC7.13
CLK1L  (via drill 0.25)
  Top 0.254: v66.99,48.58 76.52,48.58 IC7.10 | IC20.13 145.1,7.94 108.58,7.94 106.68,9.84 73.03,9.84 71.12,7.94 60.64,7.94 IC10.11
  Bottom 0.254: IC10.11 66.99,16.19 v66.99,48.58
CLK2H  (via drill 0.25)
  Top 0.254: IC13.4 88.58,53.02 v92.39,53.02 | v93.66,75.25 96.2,77.79 112.08,77.79 IC15.11
  Bottom 0.254: v92.39,53.02 93.66,54.29 v93.66,75.25 | IC20.4 145.1,22.54 145.1,20.95 144.15,20 114.94,20 114.94,18.73 114.3,18.1 111.44,18.1 111.44,50.48 110.81,51.12 110.81,62.23 113.03,64.45 IC15.11
CLK2L  (via drill 0.25)
  Top 0.254: v88.58,75.25 92.08,78.74 IC14.11 | IC20.2 141.92,30.8 v93.98,30.8
  Bottom 0.254: IC13.1 88.58,60.64 v88.58,75.25 | v93.98,30.8 91.76,33.02 91.76,75.25 IC14.11
CLK3H  (via drill 0.25)
  Top 0.254: IC17.11 114.62,10.48 144.78,10.48 145.1,10.79 145.1,13.97 IC20.8 | IC13.13 100.65,51.75 v102.23,51.75
  Bottom 0.254: v102.23,51.75 102.55,51.44 102.55,12.06 104.78,9.84 113.03,9.84 IC17.11
CLK3L  (via drill 0.25)
  Top 0.254: v100.01,44.77 IC13.10
  Bottom 0.254: 100.01,8.89 103.82,8.89 103.82,8.26 104.14,7.94 141.92,7.94 141.92,17.46 IC20.6 | 100.01,8.89 IC16.11 | 100.01,8.89 v100.01,44.77
DATA0  (via drill 0.25)
  Top 0.254: X1.A19 5.71,64.14 6.67,64.14 7.3,64.77 16.19,64.77 17.14,63.82 v23.81,63.82
  Bottom 0.254: IC5.2 24.45,47.31 24.45,52.7 25.08,53.34 25.08,57.15 24.13,58.1 IC3.2 24.13,63.5 v23.81,63.82
DATA1  (via drill 0.25)
  Top 0.254: X1.A20 6.35,67.31 12.38,67.31 14.92,69.85 v26.35,69.85
  Bottom 0.254: IC5.3 27.62,47.94 27.62,58.74 | IC3.3 27.62,58.74 | v26.35,69.85 27.62,68.58 27.62,58.74
DATA2  (via drill 0.25)
  Top 0.254: v6.35,63.18 7.3,62.23 16.19,62.23 17.14,61.28 27.62,61.28 IC3.4
  Bottom 0.254: IC5.4 30.16,47.94 30.16,58.74 IC3.4 | X1.A21 6.35,67.31 v6.35,63.18
DATA3  (via drill 0.25)
  Top 0.254: X1.A22 6.35,72.39 19.37,72.39 20.95,73.98 v32.38,73.98
  Bottom 0.254: IC5.5 32.7,47.94 32.7,58.74 | IC3.5 32.7,58.74 | v32.38,73.98 32.7,73.66 32.7,58.74
DATA4  (via drill 0.25)
  Top 0.254: X1.A23 6.35,74.93 16.19,74.93 17.14,73.98 20,73.98 20.64,74.61 v27.3,74.61
  Bottom 0.254: IC3.6 35.24,58.74 35.24,47.94 IC5.6 34.29,45.4 28.57,45.4 28.26,45.72 28.26,73.66 v27.3,74.61
DATA5  (via drill 0.25)
  Top 0.254: IC5.7 40.64,50.8 v45.09,50.8 | v46.04,60.33 45.09,61.28 38.73,61.28 | 38.73,61.28 38.42,61.28 IC3.7 | v14.29,67.31 15.88,65.72 19.37,65.72 20.64,64.45 35.56,64.45 38.73,61.28
  Bottom 0.254: v45.09,50.8 46.04,51.75 v46.04,60.33 | X1.A24 6.35,74.93 14.29,74.93 v14.29,67.31
DATA6  (via drill 0.25)
  Top 0.254: X1.A25 6.35,77.47 16.19,77.47 17.14,78.42 19.68,78.42 20.95,77.15 v39.05,77.15
  Bottom 0.254: IC5.8 40.32,47.94 40.32,58.74 | IC3.8 40.32,58.74 | v39.05,77.15 40.32,75.88 40.32,58.74
DATA7  (via drill 0.25)
  Top 0.254: X1.A26 5.71,81.92 6.67,81.92 7.3,82.55 18.73,82.55 19.05,82.87 36.2,82.87 36.83,82.23 v42.55,82.23
  Bottom 0.254: IC5.9 42.23,47.31 42.23,52.7 42.86,53.34 42.86,58.74 | IC3.9 42.86,58.74 | v42.55,82.23 42.86,81.92 42.86,58.74
DATA8
  Top 0.254: IC4.2 22.23,70.48 11.11,70.48 10.48,69.85 4.76,69.85 3.17,71.44 3.17,83.82 X1.A27
DATA9  (via drill 0.25)
  Top 0.254: v27.62,83.5 26.99,84.14 11.43,84.14 10.48,85.09 6.35,85.09 X1.A28
  Bottom 0.254: IC4.3 26.67,77.79 27.62,78.74 v27.62,83.5
DATA10  (via drill 0.25)
  Top 0.254: v28.89,77.79 28.26,78.42 20.64,78.42 17.14,81.92 v11.75,81.92
  Bottom 0.254: IC4.4 28.89,72.71 v28.89,77.79 | v11.75,81.92 11.43,82.23 11.43,86.68 10.48,87.63 5.08,87.63 X1.A29
DATA11  (via drill 0.25)
  Top 0.254: IC4.5 33.02,73.66 33.02,75.88 v14.29,75.88
  Bottom 0.254: v14.29,75.88 12.38,77.79 12.38,88.27 10.48,90.17 5.08,90.17 X1.A30
DATA12  (via drill 0.25)
  Top 0.254: v35.24,63.82 34.61,63.18 v14.29,63.18
  Bottom 0.254: IC4.6 34.61,72.07 34.61,69.22 35.24,68.58 v35.24,63.82 | v14.29,63.18 12.7,61.59 12.7,26.35 10.48,24.13 7.62,24.13 X1.B3
DATA13  (via drill 0.25)
  Top 0.254: IC4.7 38.73,70.48 v47.31,70.48 | v47.31,35.24 37.15,25.08 11.43,25.08 10.48,24.13 8.89,24.13 X1.B4
  Bottom 0.254: v47.31,35.24 v47.31,70.48
DATA14  (via drill 0.25)
  Top 0.254: IC4.8 40.96,73.98 v45.72,73.98 | v46.67,35.88 36.51,25.72 11.43,25.72 10.48,26.67 8.89,26.67 X1.B5
  Bottom 0.254: v45.72,73.98 46.67,73.03 v46.67,35.88
DATA15  (via drill 0.25)
  Top 0.254: v41.59,75.56 35.56,75.56 35.24,75.25 35.24,70.17 27.62,70.17 26.67,69.22 15.24,69.22 v12.06,66.04
  Bottom 0.254: IC4.9 41.59,72.71 v41.59,75.56 | v12.06,66.04 12.06,33.34 10.48,31.75 7.62,31.75 X1.B6
FP-ADATA0
  Bottom 0.254: IC19.18 149.54,61.91 149.54,57.78 149.86,57.47 167.64,57.47 167.64,96.52 JP1.3
FP-ADATA1
  Bottom 0.254: IC19.16 164.78,72.07 164.78,95.25 171.13,101.6 172.72,101.6 172.72,99.06 JP1.5
FP-ADATA2  (via drill 0.25)
  Top 0.254: IC19.14 152.08,54.29 152.72,54.29 v168.28,69.85
  Bottom 0.254: v168.28,69.85 168.28,92.08 JP1.7
FP-ADATA3
  Bottom 0.254: IC19.12 152.72,49.85 152.72,51.44 151.76,52.39 149.54,52.39 149.54,56.52 149.86,56.83 168.91,56.83 168.91,90.17 JP1.9
FP-ADATA4  (via drill 0.25)
  Top 0.254: IC19.9 150.18,54.93 152.4,54.93 v169.54,72.07
  Bottom 0.254: v169.54,72.07 169.54,88.27 JP1.11
FP-ADATA5  (via drill 0.25)
  Top 0.254: IC19.7 149.54,59.37 154.31,59.37 171.13,76.2 v171.77,76.2
  Bottom 0.254: v171.77,76.2 172.72,77.15 172.72,86.36 JP1.13
FP-ADATA6
  Top 0.254: IC19.5 145.1,60.01 152.4,60.01 170.18,77.79 170.18,80.33 171.13,81.28 174.31,81.28 175.26,82.23 175.26,83.82 172.72,83.82 JP1.15
FP-ADATA7
  Top 0.254: IC19.3 145.1,65.09 153.99,65.09 JP1.17
FP-ADATA8
  Top 0.254: IC18.18 153.67,99.06 172.72,99.06 JP1.4
FP-ADATA9
  Top 0.254: IC18.16 156.21,96.52 172.72,96.52 JP1.6
FP-ADATA10  (via drill 0.25)
  Top 0.254: v158.75,93.98 172.72,93.98 JP1.8
  Bottom 0.254: v158.75,93.98 IC18.14
FP-ADATA11
  Bottom 0.254: IC18.12 164.15,94.3 164.15,97.16 171.13,104.14 175.26,104.14 175.26,93.98 JP1.10
FP-ADATA12
  Top 0.254: IC18.9 145.1,82.87 145.1,85.41 170.18,85.41 171.13,86.36 174.31,86.36 175.26,87.31 175.26,90.17 JP1.12
FP-ADATA13
  Top 0.254: IC18.7 145.1,87.95 170.18,87.95 171.13,88.9 172.72,88.9 JP1.14
FP-ADATA14
  Top 0.254: IC18.5 143.83,91.12 149.22,91.12 149.86,90.49 170.18,90.49 171.13,91.44 174.94,91.44 175.9,90.49 175.9,85.09 JP1.16
FP-ADATA15  (via drill 0.25)
  Top 0.254: v145.73,84.77 170.18,84.77 171.13,83.82 171.77,83.82 173.04,82.55 JP1.18
  Bottom 0.254: IC18.3 145.73,94.3 v145.73,84.77
FP-CLK0H  (via drill 0.25)
  Top 0.254: v141.29,50.8 142.88,52.39 145.41,52.39 150.5,57.47 153.99,57.47 JP1.23
  Bottom 0.254: IC20.5 141.29,23.81 v141.29,50.8
FP-CLK0L
  Top 0.254: IC20.3 145.1,28.26 152.4,28.26 175.26,51.12 175.26,71.12 172.72,71.12 JP1.25
FP-CLK1H
  Top 0.254: IC20.9 141.92,13.02 141.92,20.64 152.4,20.64 175.9,44.13 175.9,78.74 172.72,78.74 JP1.19
FP-CLK1L  (via drill 0.25)
  Top 0.254: IC20.7 147,20 v153.35,20
  Bottom 0.254: v153.35,20 170.18,36.83 170.18,76.2 JP1.21
FP-CLK2H  (via drill 0.25)
  Top 0.254: IC20.16 151.45,21.91 152.08,21.91 v175.26,45.09
  Bottom 0.254: v175.26,45.09 175.26,73.66 JP1.24
FP-CLK2L  (via drill 0.25)
  Top 0.254: IC20.18 152.08,27.62 152.72,27.62 v172.72,47.62
  Bottom 0.254: v172.72,47.62 172.72,71.12 JP1.26
FP-CLK3H
  Top 0.254: IC20.12 176.53,36.83 176.53,80.01 JP1.20
FP-CLK3L  (via drill 0.25)
  Top 0.254: v175.9,41.27 IC20.14
  Bottom 0.254: v175.9,41.27 175.9,75.56 JP1.22
GND  (via drill 0.25)
  Top 0.254: IC18.10 148.91,73.34 148.91,72.39 C3.2 | C1.2 152.4,109.22 170.18,109.22 J1.2 | JP1.40 JP1.39 163.51,46.67 144.46,46.67 IC19.10 | C22.2 58.1,34.61 73.98,34.61 | C21.2 73.98,34.61 | 91.76,34.61 C7.2 | 73.98,34.61 91.76,34.61 | 109.54,34.61 C2.2 | 91.76,34.61 109.54,34.61 | IC16.10 88.58,7.94 104.46,7.94 IC17.10 | IC22.8 IC10.10 53.02,9.84 68.9,9.84 IC11.10 | X1.A32 X1.B32 X1.C32 12.7,96.52 C11.2 | X1.A1 X1.B1 X1.C1 12.06,15.88 15.88,15.88 C14.2 | C12.2 58.1,104.46 73.98,104.46 | C13.2 73.98,104.46 | 91.76,104.46 C15.2 | 73.98,104.46 91.76,104.46 | C4.2 109.54,104.46 91.76,104.46 | C5.2 58.1,62.55 73.98,62.55 | C19.2 73.98,62.55 | 86.68,79.69 IC14.10 | 86.68,79.69 70.8,79.69 IC9.10 68.9,79.69 53.02,79.69 IC8.10 49.85,76.52 | 91.76,62.55 C9.2 | 73.98,62.55 91.76,62.55 | IC15.10 104.46,79.69 86.68,79.69 | C16.2 109.54,62.55 91.76,62.55 | 86.68,43.5 70.8,43.5 IC7.7 61.91,44.45 60.96,45.4 53.02,45.4 IC6.7 46.99,44.45 IC5.10 | IC13.7 86.68,43.5 | IC12.7 104.46,43.5 86.68,43.5 | 49.85,76.52 45.72,72.39 IC4.10 | IC1.7 39.37,83.82 v45.09,83.82 | C6.2 18.73,76.52 49.85,76.52 | C8.2 147.64,34.61 109.54,34.61
  Bottom 0.254: C1.2 C3.2 | C8.2 148.59,31.43 | 148.59,31.43 148.59,13.97 IC20.10 143.51,2.86 165.74,2.86 166.05,3.17 166.05,3.81 PWR.K | 145.1,44.13 IC19.10 | 145.1,44.13 145.1,34.92 148.59,31.43 | IC18.10 145.1,77.15 145.1,44.13 | IC22.8 39.37,12.38 38.42,13.34 38.42,20 IC2.7 39.37,24.13 IC21.8 42.86,37.78 42.86,48.58 44.45,50.16 | IC16.10 79.06,8.89 79.06,8.26 78.74,7.94 74.93,7.94 | 74.93,7.94 69.85,7.94 IC11.10 | 74.93,7.94 C21.2 | 18.73,27.62 C10.2 | 18.73,38.42 18.73,27.62 | C18.2 18.73,38.42 | 18.73,51.12 C20.2 | 18.73,38.42 18.73,51.12 | 18.73,63.82 C17.2 | 18.73,51.12 18.73,63.82 | 18.73,63.82 18.73,76.52 C6.2 16.83,78.42 16.83,90.49 C11.2 | C14.2 18.73,14.92 18.73,27.62 | 71.44,77.15 74.93,73.66 C19.2 | 71.44,77.15 IC9.10 | C13.2 73.34,107 71.44,107 71.44,77.15 | 45.4,60.64 IC3.10 | 45.4,60.64 45.4,71.44 IC4.10 44.45,73.66 45.4,74.61 45.4,83.5 v45.09,83.82 | 44.45,50.16 44.45,52.39 45.4,53.34 45.4,60.64 | 44.45,50.16 IC5.10
N$1  (via drill 0.25)
  Top 0.254: IC6.3 53.02,55.56 v55.56,55.56
  Bottom 0.254: v55.56,55.56 55.56,77.47 54.29,78.74 54.29,99.38 IC8.1
N$2  (via drill 0.25)
  Top 0.254: IC2.13 25.72,30.8 32.7,30.8 | IC2.9 32.7,30.8 | IC1.8 40.64,90.17 v61.91,90.17 | v62.55,42.86 56.83,37.15 55.24,37.15 54.61,36.51 43.81,36.51 38.1,30.8 32.7,30.8
  Bottom 0.254: v61.91,90.17 62.55,89.53 v62.55,42.86
N$3
  Top 0.254: IC1.3 25.08,84.77 23.5,84.77 23.18,85.09 23.18,92.39 30.16,92.39 IC1.10
N$5  (via drill 0.25)
  Top 0.254: IC2.12 28.26,27.62 v34.92,27.62 | v36.83,83.19 35.24,84.77 v30.16,84.77
  Bottom 0.254: v34.92,27.62 35.88,28.57 35.88,82.23 v36.83,83.19 | v30.16,84.77 30.16,93.03 IC1.11
N$6
  Bottom 0.254: IC2.3 25.08,20 25.08,15.24 24.77,14.92 22.54,14.92 22.54,33.34 IC21.1
N$7  (via drill 0.25)
  Top 0.254: v31.43,24.45 IC2.6
  Bottom 0.254: v31.43,24.45 27.62,28.26 27.62,31.11 25.08,33.66 25.08,40.96 IC21.15
N$8
  Top 0.254: J1.1 R1.1 | IC18.1 146.05,99.06 IC18.19 | IC20.19 148.59,31.75 IC20.1 | IC19.19 148.59,68.58 IC19.1
  Bottom 0.254: R1.1 153.67,99.06 IC18.19 | IC20.1 142.24,33.02 142.24,44.77 141.92,45.09 141.92,66.99 | IC19.1 141.92,66.99 | IC18.1 141.92,100.01 141.92,66.99
N$11
  Top 0.254: R2.1 166.05,2.86 174.31,2.86 PWR.A
N$12  (via drill 0.25)
  Top 0.254: v53.02,38.1 59.37,44.45 IC6.8
  Bottom 0.254: IC10.1 53.02,32.7 v53.02,38.1
N$15  (via drill 0.25)
  Top 0.254: IC12.3 101.92,58.1 v100.97,58.1
  Bottom 0.254: v100.97,58.1 99.38,59.69 99.38,97.16 95.89,100.65 87.63,100.65 IC14.1
N$16
  Top 0.254: IC21.5 28.89,31.43 10.79,31.43 10.48,31.75 4.76,31.75 0.64,35.88 0.64,107.95 3.81,107.95 J2.3
N$17  (via drill 0.25)
  Top 0.254: IC16.1 89.85,33.97 v112.08,33.97
  Bottom 0.254: v112.08,33.97 113.03,34.92 IC12.8
N$18  (via drill 0.25)
  Top 0.254: IC21.6 32.07,36.51 v28.26,36.51 | v26.35,38.42 11.43,38.42 10.48,39.37 4.76,39.37 2.54,41.59 2.54,99.69 3.49,99.69 7.62,103.82 J2.5
  Bottom 0.254: v26.35,38.42 v28.26,36.51
N$19  (via drill 0.25)
  Top 0.254: IC11.1 68.9,30.8 v57.47,30.8
  Bottom 0.254: v57.47,30.8 57.47,34.29 61.28,38.1 61.28,50.48 IC6.11
N$20  (via drill 0.25)
  Top 0.254: IC21.7 40.01,37.47 54.61,37.47 60.64,43.5 v63.18,43.5
  Bottom 0.254: v63.18,43.5 63.18,104.78 58.42,109.54 10.16,109.54 J2.7
N$21  (via drill 0.25)
  Top 0.254: IC12.11 v107,46.04
  Bottom 0.254: IC17.1 107,33.34 v107,46.04
N$23
  Bottom 0.254: IC12.6 107,48.58 107,100.01 IC15.1
N$24  (via drill 0.25)
  Top 0.254: v27.62,7.62 21.27,1.27 6.35,1.27 J3.3
  Bottom 0.254: IC21.11 32.7,40.32 32.7,14.61 27.62,9.53 v27.62,7.62
N$25  (via drill 0.25)
  Top 0.254: IC6.6 53.02,47.94 v63.82,47.94
  Bottom 0.254: v63.82,47.94 66.99,51.12 66.99,98.74 IC9.1
N$26  (via drill 0.25)
  Top 0.254: IC21.10 32.07,37.15 20.95,37.15 17.46,33.66 v17.14,33.66
  Bottom 0.254: v17.14,33.66 15.88,32.38 15.88,12.7 8.89,5.71 8.89,3.81 J3.5
N$27
  Bottom 0.254: IC21.9 38.42,40.96 38.42,27.94 33.34,22.86 33.34,12.7 30.16,9.53 30.16,7.62 25.08,2.54 J3.7
N$37  (via drill 0.25)
  Top 0.254: v37.78,56.83 26.35,56.83 IC5.19
  Bottom 0.254: IC2.8 37.78,30.16 v37.78,56.83
N$38  (via drill 0.25)
  Top 0.254: v30.16,44.77 30.16,50.8 v26.99,50.8
  Bottom 0.254: 25.08,68.26 IC3.19 | 25.08,68.26 25.08,79.06 IC4.19 | IC2.11 30.16,30.16 v30.16,44.77 | v26.99,50.8 25.72,52.07 25.72,57.47 25.08,58.1 25.08,68.26
REG-LD-ID0  (via drill 0.25)
  Top 0.254: IC22.14 25.08,18.1 v14.61,18.1 | v13.34,44.45 10.79,46.99 8.89,46.99 X1.B13
  Bottom 0.254: v14.61,18.1 13.34,19.37 v13.34,44.45
REG-LD-ID1  (via drill 0.25)
  Top 0.254: IC22.13 26.67,19.05 v14.61,19.05 | v13.97,46.99 11.43,49.53 8.89,49.53 X1.B14
  Bottom 0.254: v14.61,19.05 13.97,19.68 v13.97,46.99
REG-LD-ID2  (via drill 0.25)
  Top 0.254: IC21.14 25.08,43.5 25.08,44.77 15.24,44.77 v11.43,48.58
  Bottom 0.254: v11.43,48.58 10.48,49.53 8.89,49.53 8.89,52.07 X1.B15
REG-LD-ID3  (via drill 0.25)
  Top 0.254: IC21.13 25.72,45.4 17.14,45.4 10.48,52.07 v9.84,52.07
  Bottom 0.254: v9.84,52.07 8.89,53.02 8.89,54.61 X1.B16
REG-RD-ID0  (via drill 0.25)
  Top 0.254: IC22.2 19.05,3.81 1.91,3.81 0.64,5.08 0.64,22.54 v0.95,22.54
  Bottom 0.254: v0.95,22.54 3.17,24.77 3.17,35.24 4.76,36.83 7.62,36.83 X1.B9
REG-RD-ID1  (via drill 0.25)
  Top 0.254: IC22.3 26.67,14.92 29.84,14.92 30.16,15.24 30.16,19.68 v12.38,19.68
  Bottom 0.254: v12.38,19.68 10.48,21.59 3.81,21.59 3.81,33.34 4.76,34.29 8.89,34.29 8.89,39.37 X1.B10
REG-RD-ID2  (via drill 0.25)
  Top 0.254: v23.81,39.05 22.54,40.32 12.06,40.32 10.48,41.91 8.89,41.91 X1.B11
  Bottom 0.254: IC21.2 23.81,34.61 v23.81,39.05
REG-RD-ID3  (via drill 0.25)
  Top 0.254: v24.45,43.81 11.11,43.81 10.48,44.45 8.89,44.45 X1.B12
  Bottom 0.254: IC21.3 25.72,35.24 25.72,42.55 v24.45,43.81
VCC
  Top 0.254: X1.A31 X1.B31 X1.C31 12.7,93.98 17.46,89.22 | RN2.1 RN1.1 19.37,107 53.02,107 C12.1 54.93,105.09 | 25.08,95.57 23.18,95.57 IC1.14 21.59,93.34 17.46,89.22 | IC1.12 25.08,95.57 | IC1.9 32.7,95.57 25.08,95.57 | 17.46,89.22 C11.1 | X1.A2 X1.B2 X1.C2 13.97,16.51 IC22.16 21.59,15.24 C14.1 | 58.74,32.7 56.83,34.61 55.56,34.61 54.93,35.24 | 58.74,32.7 IC10.20 | 58.74,32.7 76.52,32.7 IC11.20 78.42,30.8 88.9,30.8 89.53,31.43 94.93,31.43 IC16.20 96.2,32.7 112.08,32.7 IC17.20 113.98,32.7 151.13,32.7 | 89.22,36.51 73.34,36.51 C21.1 60.96,35.56 60.01,36.51 56.2,36.51 54.93,35.24 | C7.1 89.22,36.51 | C2.1 107.63,35.88 93.98,35.88 93.34,36.51 89.22,36.51 | IC6.14 56.83,62.55 55.56,62.55 54.93,63.18 | 94.3,60.64 IC13.14 | 94.3,60.64 78.42,60.64 IC7.14 | IC12.14 112.08,60.64 94.3,60.64 | 89.22,64.45 C9.1 | 73.34,64.45 89.22,64.45 | C19.1 73.34,64.45 | C16.1 107,64.45 89.22,64.45 | 54.93,63.18 56.2,64.45 73.34,64.45 | 54.93,63.18 C5.1 | 54.93,35.24 C22.1 | C3.1 149.86,68.58 IC19.20 | C8.1 147,36.51 149.22,36.51 151.13,34.61 151.13,32.7 | IC20.20 151.13,32.7 | JP1.2 JP1.1 170.18,101.6 IC18.20 149.86,101.6 C1.1 | 54.93,105.09 58.42,101.6 IC8.20 | 54.93,105.09 56.2,106.36 71.44,106.36 C13.1
  Bottom 0.254: IC1.4 28.26,87.31 28.26,92.39 IC1.12 | RN2.1 19.37,100.65 21.59,100.65 IC1.14 22.54,93.03 22.54,79.06 | 16.83,48.58 16.83,37.78 C18.1 17.78,28.26 16.83,27.3 16.83,23.18 | C20.1 16.83,48.58 | 16.83,61.28 C17.1 | 16.83,48.58 16.83,61.28 | C6.1 17.78,66.36 16.83,65.41 16.83,61.28 | 16.83,23.18 C10.1 | 16.83,23.18 16.83,12.38 C14.1 | 20.64,30.16 IC2.14 | 20.64,30.16 20.64,40.96 IC21.16 22.54,42.86 22.54,55.56 | 22.54,55.56 IC5.20 | 22.54,66.36 22.54,55.56 | IC3.20 22.54,66.36 | 22.54,79.06 IC4.20 | 22.54,66.36 22.54,79.06 | IC22.16 20.64,17.46 20.64,30.16 | 72.39,59.69 IC7.14 | C19.1 72.39,59.69 | 72.39,59.69 C21.1 | R2.2 152.72,6.03 152.72,30.16 IC20.20 | C8.1 C3.1 146.37,72.71 146.37,105.09 C1.1 113.03,105.41 IC15.20 111.76,101.6 C4.1 95.25,105.41 IC14.20 93.98,101.6 C15.1 77.47,105.41 IC9.20 76.2,101.6 C13.1 | R1.2 151.13,106.68 IC18.20

## Text on the board
tNames: YACC1 REGISTER BOARD-4 3.0 | FP-ENABLE | 0 | RD | 3 | 1 | 0 | LD | 3 | onepagecomputer.com